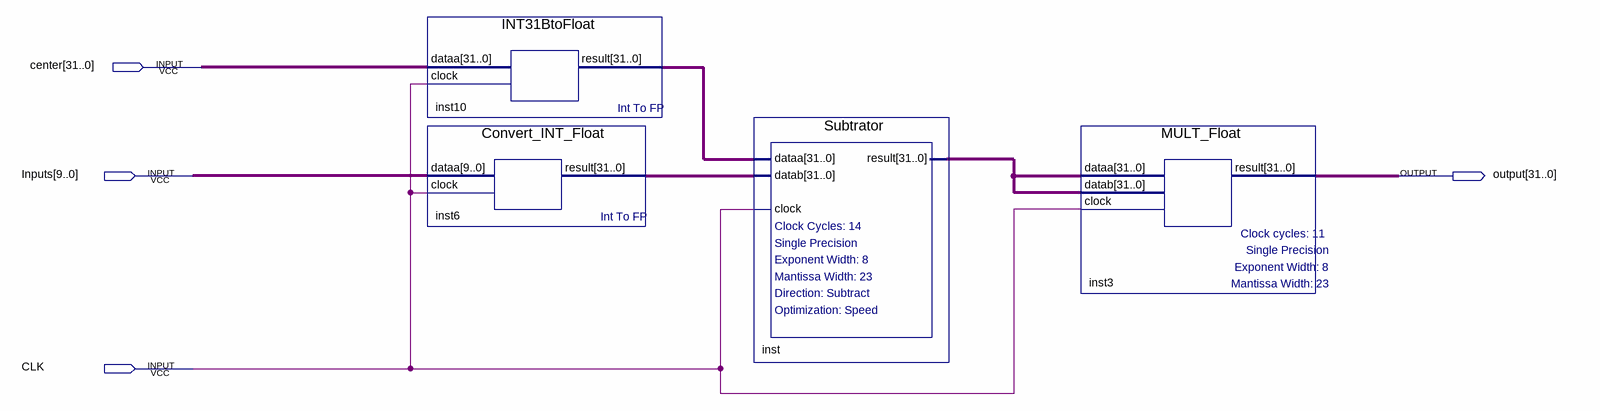
[diagram p0: schematic sheet]
// Quartus schematic DIF_comp.bdf as structural Verilog: 4 symbols, 4 pins
module DIF_comp (
  input  [31:0] center,
  input  [9:0] Inputs,
  input  CLK,
  output [31:0] \output 
);

  wire [31:0] inst6_result, inst10_result, inst_result;

  INT31BtoFloat inst10 (.dataa(center), .clock(CLK), .result(inst10_result));
  Convert_INT_Float inst6 (.dataa(Inputs), .clock(CLK), .result(inst6_result));
  Subtrator inst (.dataa(inst10_result), .datab(inst6_result), .clock(CLK), .result(inst_result));
  MULT_Float inst3 (.dataa(inst_result), .datab(inst_result), .clock(CLK), .result(\output ));
endmodule
